# EAGLE design Adafruit NeoKey 1x4 QT I2C (EAGLE 9.6.2)
COMPANY: ADAFRUIT INDUSTRIES; DRAWN: KTOWN; REV: A
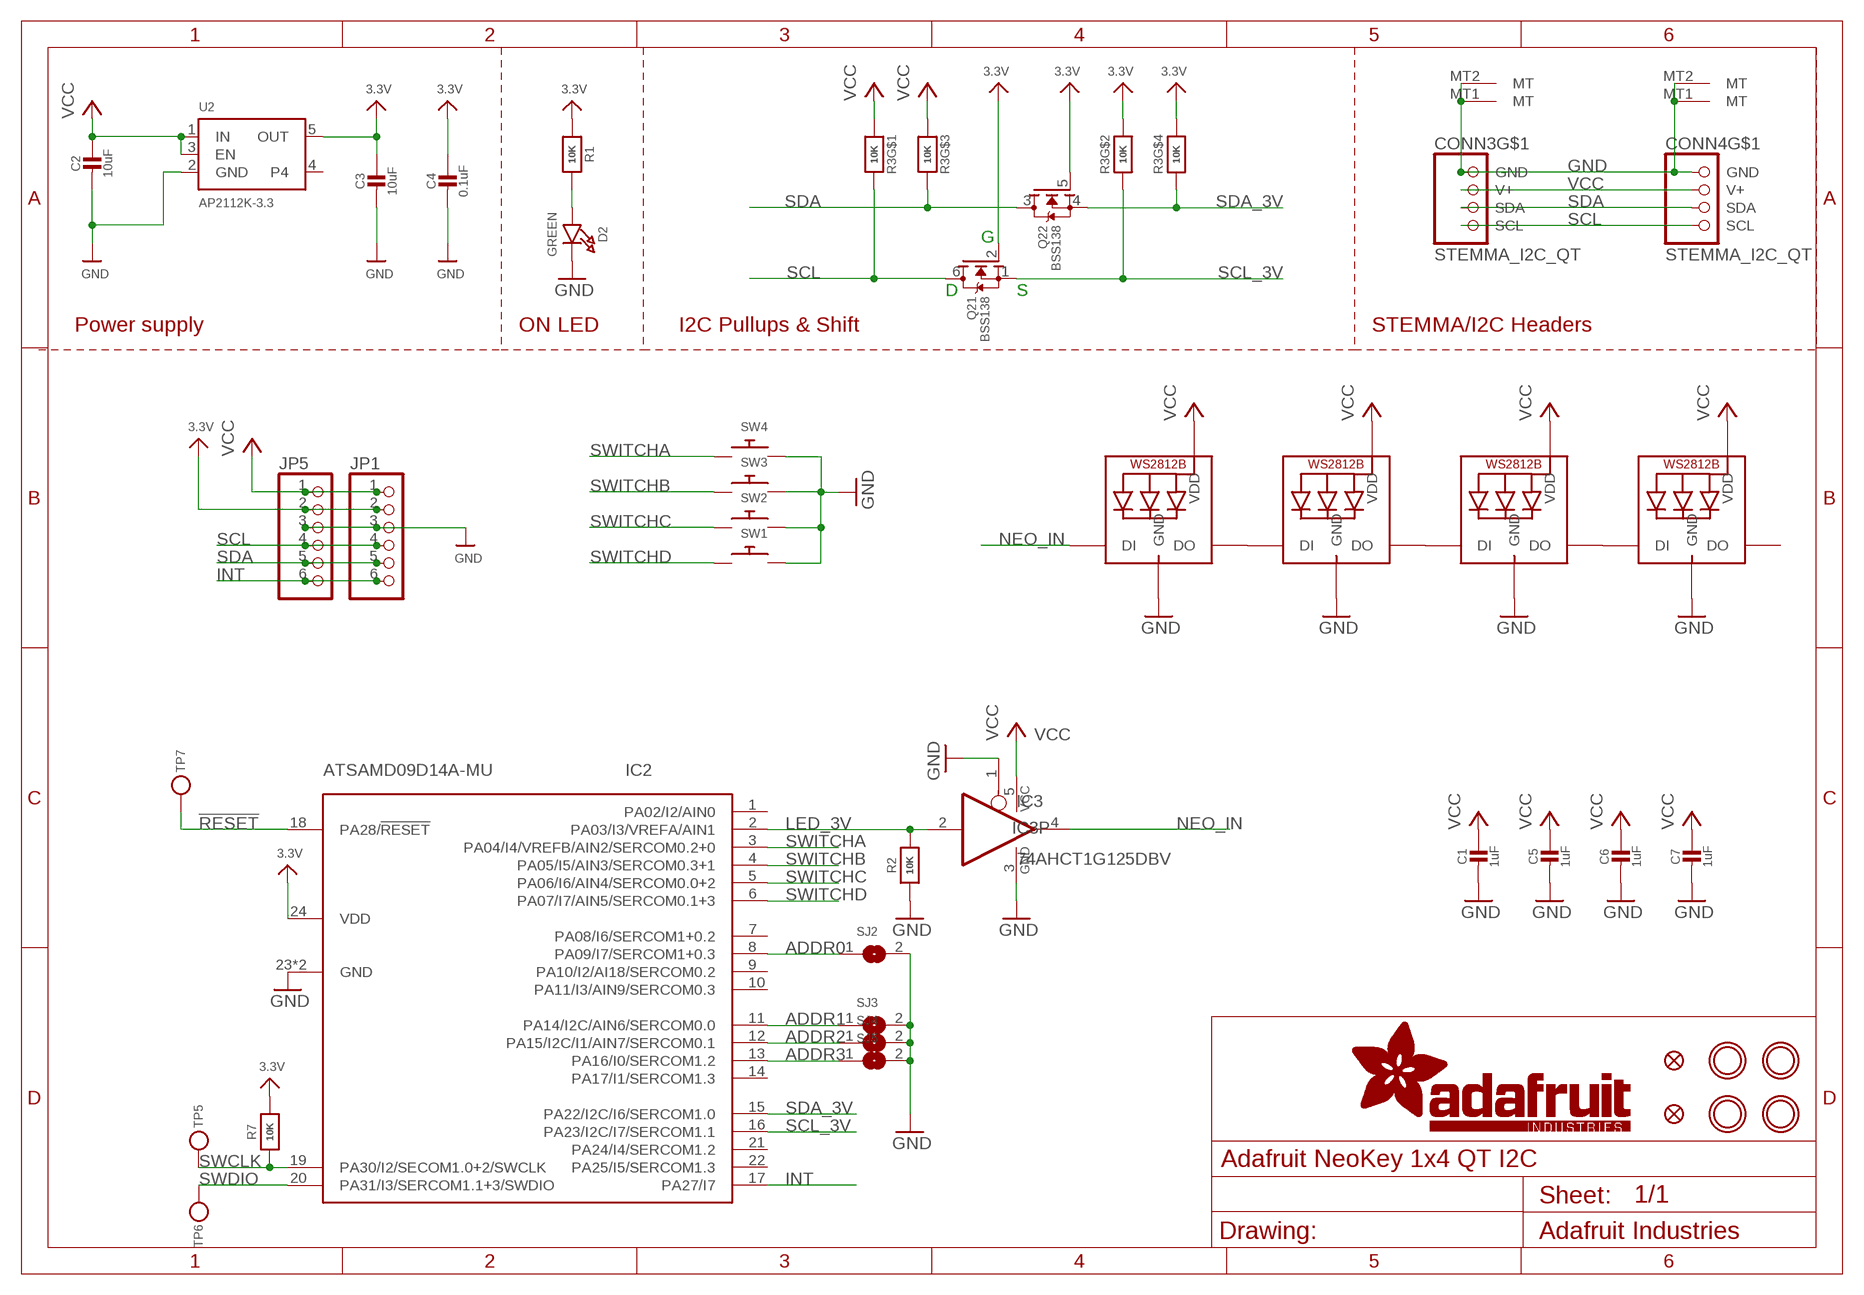
[diagram p0: schematic, sheet 1]

## Parts
C1  1uF  CAP_CERAMIC0603_NO  [0603-NO]
C2  10uF  CAP_CERAMIC0805-NOOUTLINE  [0805-NO]
C3  10uF  CAP_CERAMIC0805-NOOUTLINE  [0805-NO]
C4  0.1uF  CAP_CERAMIC0603_NO  [0603-NO]
C5  1uF  CAP_CERAMIC0603_NO  [0603-NO]
C6  1uF  CAP_CERAMIC0603_NO  [0603-NO]
C7  1uF  CAP_CERAMIC0603_NO  [0603-NO]
CONN3  STEMMA_I2C_QT  [JST_SH4]
CONN4  STEMMA_I2C_QT  [JST_SH4]
D2  GREEN  LED0603_NOOUTLINE  [CHIPLED_0603_NOOUTLINE]
FID1  FIDUCIAL_1MM  [FIDUCIAL_1MM]
FID2  FIDUCIAL_1MM  [FIDUCIAL_1MM]
IC2  ATSAMD09D14A-MU  [QFN24_4MM]
IC3  74AHCT1G125DBV  [SOT23-5]
JP1  HEADER-1X670MIL  [1X06_ROUND_70]
JP5  HEADER-1X670MIL  [1X06_ROUND_70]
LED1  WS2812B_SK6812E  [NEO3535_REVERSE]
LED2  WS2812B_SK6812E  [NEO3535_REVERSE]
LED3  WS2812B_SK6812E  [NEO3535_REVERSE]
LED4  WS2812B_SK6812E  [NEO3535_REVERSE]
Q2  BSS138  MOSFET-N_DUAL  [SOT363]
R1  10K  RESISTOR_0603_NOOUT  [0603-NO]
R2  10K  RESISTOR_0603_NOOUT  [0603-NO]
R3  10K  RESISTOR_4PACK  [RESPACK_4X0603]
R7  10K  RESISTOR_0603_NOOUT  [0603-NO]
SJ2  SOLDERJUMPER  [SOLDERJUMPER_ARROW_NOPASTE]
SJ3  SOLDERJUMPER  [SOLDERJUMPER_ARROW_NOPASTE]
SJ4  SOLDERJUMPER  [SOLDERJUMPER_ARROW_NOPASTE]
SJ5  SOLDERJUMPER  [SOLDERJUMPER_ARROW_NOPASTE]
SW1  SWITCH_PUSHBUTTON_KAILH_SOCKET  [KAILH_SOCKET]
SW2  SWITCH_PUSHBUTTON_KAILH_SOCKET  [KAILH_SOCKET]
SW3  SWITCH_PUSHBUTTON_KAILH_SOCKET  [KAILH_SOCKET]
SW4  SWITCH_PUSHBUTTON_KAILH_SOCKET  [KAILH_SOCKET]
TP5  TESTPOINTROUND1.5MM  [TESTPOINT_ROUND_1.5MM]
TP6  TESTPOINTROUND1.5MM  [TESTPOINT_ROUND_1.5MM]
TP7  TESTPOINTROUND1.5MM  [TESTPOINT_ROUND_1.5MM]
U2  AP2112K-3.3  VREG_SOT23-5  [SOT23-5]
U$3  MOUNTINGHOLE2.5  [MOUNTINGHOLE_2.5_PLATED]
U$17  MOUNTINGHOLE2.5  [MOUNTINGHOLE_2.5_PLATED]
U$19  MOUNTINGHOLE2.5  [MOUNTINGHOLE_2.5_PLATED]
U$21  MOUNTINGHOLE2.5  [MOUNTINGHOLE_2.5_PLATED]

## Nets
3.3V [lowpower]: C3.1 C4.1 IC2.24(VDD) JP1.2 JP5.2 Q2.2(1:G) Q2.5(2:G) R1.1 R3.2 R3.4 R7.2 U2.5(OUT)
!RESET: IC2.18(PA28/!RESET) TP7.P$1
ADDR0: IC2.8(PA09/I7/SERCOM1+0.3) SJ2.1
ADDR1: IC2.11(PA14/I2C/AIN6/SERCOM0.0) SJ3.1
ADDR2: IC2.12(PA15/I2C/I1/AIN7/SERCOM0.1) SJ4.1
ADDR3: IC2.13(PA16/I0/SERCOM1.2) SJ5.1
GND: C1.2 C2.2 C3.2 C4.2 C5.2 C6.2 C7.2 CONN3.1(GND) CONN3.MT1(MT) CONN3.MT2(MT) CONN4.1(GND) CONN4.MT1(MT) CONN4.MT2(MT) D2.C IC2.23(GND) IC2.THERM(GND) IC3.1(OE) IC3.3(GND) JP1.3 JP5.3 LED1.3-GND(GND) LED2.3-GND(GND) LED3.3-GND(GND) LED4.3-GND(GND) R2.1 SJ2.2 SJ3.2 SJ4.2 SJ5.2 SW1.1 SW2.1 SW3.1 SW4.1 U2.2(GND)
INT: IC2.17(PA27/I7) JP1.6 JP5.6
LED_3V: IC2.2(PA03/I3/VREFA/AIN1) IC3.2(I) R2.2
N$1: D2.A R1.2
N$2: LED1.2-DOUT(DO) LED2.4-DIN(DI)
N$3: LED2.2-DOUT(DO) LED3.4-DIN(DI)
N$4: LED3.2-DOUT(DO) LED4.4-DIN(DI)
NEO_IN: IC3.4(O) LED1.4-DIN(DI)
SCL: CONN3.4(SCL) CONN4.4(SCL) JP1.4 JP5.4 Q2.6(1:D) R3.8
SCL_3V: IC2.16(PA23/I2C/I7/SERCOM1.1) Q2.1(1:S) R3.7
SDA: CONN3.3(SDA) CONN4.3(SDA) JP1.5 JP5.5 Q2.3(2:D) R3.6
SDA_3V: IC2.15(PA22/I2C/I6/SERCOM1.0) Q2.4(2:S) R3.5
SWCLK: IC2.19(PA30/I2/SECOM1.0+2/SWCLK) R7.1 TP5.P$1
SWDIO: IC2.20(PA31/I3/SERCOM1.1+3/SWDIO) TP6.P$1
SWITCHA: IC2.3(PA04/I4/VREFB/AIN2/SERCOM0.2+0) SW4.2
SWITCHB: IC2.4(PA05/I5/AIN3/SERCOM0.3+1) SW3.2
SWITCHC: IC2.5(PA06/I6/AIN4/SERCOM0.0+2) SW2.2
SWITCHD: IC2.6(PA07/I7/AIN5/SERCOM0.1+3) SW1.2
VCC [power]: C1.1 C2.1 C5.1 C6.1 C7.1 CONN3.2(V+) CONN4.2(V+) IC3.5(VCC) JP1.1 JP5.1 LED1.1-VDD(VDD) LED2.1-VDD(VDD) LED3.1-VDD(VDD) LED4.1-VDD(VDD) R3.1 R3.3 U2.1(IN) U2.3(EN)
Unconnected: IC2.1(PA02/I2/AIN0) IC2.7(PA08/I6/SERCOM1+0.2) IC2.9(PA10/I2/AI18/SERCOM0.2) IC2.10(PA11/I3/AIN9/SERCOM0.3) IC2.14(PA17/I1/SERCOM1.3) IC2.21(PA24/I4/SERCOM1.2) IC2.22(PA25/I5/SERCOM1.3) LED4.2-DOUT(DO) U2.4

## Notes on the sheet
- G
- D | S
- Power supply | ON LED | I2C Pullups & Shift | STEMMA/I2C Headers

## Library data of the parts
C1-C7 = microbuilder:CAP_CERAMIC: Ceramic Capacitors For new designs, use the packages preceded by an '_' character since they are more reliable: The following footprints should be used on most boards: _0402 - Standard footprint for regular board layouts _0603 - Standard footprint for regular board layouts _0805 - Standard footprint for regular board layouts _1206 - Standard footprint for regular board layouts For extremely tight-pitch boards where space is at a premium, the following 'micro-pitch' footprints can be used (smaller pads, no silkscreen outline, etc.): _0402MP - Micro-pitch footprint for very dense/compact boards _0603MP - Micro-pitch footprint for very dense/compact boards _0805MP - Micro-pitch footprint for very dense/compact boards _1206MP - Micro-pitch footprint for very dense/compact boards
CONN3 CONN4 = microbuilder:STEMMA_I2C
D2 = microbuilder:LED: LED 0603 - 0603 Surface Mount Package 2mA: Green LED - Low Power (3.9mcd, 2ma, 1.7Vf) - Digikey: 475-2709-2-ND Orange LED - Low Power (9.8mcd, 2ma, 1.8Vf) - Digikey: 475-1194-2-ND Red LED - Low Power (5mcd, 2ma, 1.8Vf) - Digikey: 475-1195-2-ND Yellow LED - Low Power (7mcd, 2ma, 1.8Vf) - Digikey: 475-1196-2-ND 5mA: Blue LED - Low Power (17mcd, 5ma, 2.9Vf) - Digikey: LNJ937W8CRACT-ND 0805 - 0805 Surface Mount Package 2mA: Red LED (8.8mcd, 2mA, 1.8Vf, Clear) - Low Power [Digikey: 475-2510-1-ND] Green LED (5mcd, 2mA, 1.8Vf, Clear) - Low Power [Digikey: 475-2730-1-ND] Yellow LED (11.3mcd, 2mA, 1.8Vf, Clear) - Low Power [Digikey: 475-2555-1-ND] 20mA: Red LED (104mcd, 20mA, Diffused) - LS R976 [Digikey: 475-1278-6-ND] Red LED (12mcd, 20mA, 2.0Vf, Clear) - APT2012EC [Digikey: 754-1128-1-ND] Green LED (15mcd, 20mA, 2.2Vf, Clear) - APT2012GC [Digikey: 754-1131-1-ND] Orange LED (160mcd, 20mA, 2.1Vf, Clear) - APT2012SECK [Digikey: 754-1130-1-ND] 1206 - 1206 Surface Mount Package Green LED (26mcd, 20mA, Diffused) - LG N971 [Digikey: 475-1407-6-ND] Red LED (15mcd, 20mA, Diffused) - LH N974 [Digikey: 475-1416-6-ND] Cree - Cree High-Power Surface Mount LEDs XPEBWT-L1-0000-00D50 - White 111lm 350mA 2.9Vf 6200K 110° XTEAWT-00-0000-00000LEE3 - White 114lm 350mA 2.85Vf 5000K 115° Everlight - Everlight 45-21 Series Surface Mount LEDs 45-21/QK2C-B2832AC2CB2/2T - Warm White 2000mcd 20mA 3.25Vf 3050K 120° 45-21/LK2C-B38452C4CB2/2T - Nuetral White 2000mcd 20mA 3.25Vf 4150K 120° 45-21/LK2C-B50634C6CB2/2T - Cold White 2200mcd 20mA 3.25Vf 5650K 120° PLCC2 Reverse Mount LS T77K-J1L2-1-0-2-R18-Z - Red 11.25mcd 2mA 1.8Vf 630nm 120° LO T77K-L1M2-24-Z - Orange 19.6mcd 2mA 1.8Vf 606nm 120° LY T77K-K2M1-26-Z - Yellow 15.7mcd 2mA 1.8Vf 587nm 120°
FID1 FID2 = microbuilder:FIDUCIAL: Fiducial Alignment Points Various fiducial points for machine vision alignment.; BOM: EXCLUDE
IC2 = microbuilder:ATSAMD09D14A
IC3 = 74xx-little-us:74*1G125: Single Bus Buffer Gate with 3-State Output
JP1 JP5 = microbuilder:HEADER-1X6: PIN HEADER
LED1-LED4 = microbuilder:WS2812B
Q2 = microbuilder:MOSFET-N_DUAL: Dual N-Channel MOSFET SOT363 (2.0x1.25mm) 2N7002PS - 60V, 320mA [Digikey: 568-5984-1-ND]
R1 R2 R7 = microbuilder:RESISTOR: Resistors For new designs, use the packages preceded by an '_' character since they are more reliable: The following footprints should be used on most boards: _0402 - Standard footprint for regular board layouts _0603 - Standard footprint for regular board layouts _0805 - Standard footprint for regular board layouts _1206 - Standard footprint for regular board layouts For extremely tight-pitch boards where space is at a premium, the following 'micro-pitch' footprints can be used (smaller pads, no silkscreen outline, etc.): _0402MP - Micro-pitch footprint for very dense/compact boards _0603MP - Micro-pitch footprint for very dense/compact boards _0805MP - Micro-pitch footprint for very dense/compact boards _1206MP - Micro-pitch footprint for very dense/compact boards
R3 = microbuilder:RESISTOR_4PACK: Resistor Packs (4 resistors) 4 x 0603 10K 1/16W - Digikey: YC164J-10KCT-ND
SJ2-SJ5 = microbuilder:SOLDERJUMPER: SMD Solder JUMPER Solder the two pads together to create a connection, or remove the solder to break it. REFLOW - Use this footprint for solder paste and reflow ovens. WAVE - Use this footprint for hand-soldering (larger pads). CLOSED - Has a trace between the two pads to ensure it is closed by default. The trace needs to be cut to disable the jumper, and can be closed again by creating a solder bridge between the two pads.; BOM: EXCLUDE
SW1-SW4 = adafruit_electromech:SWITCH_PUSHBUTTON: Buttons SOFTTOUCHSMD_SJ - Soft touch temporary push button (Super Junk Akihabara) Compatible with SKPMANE010 [Mouser: 688-SKPMAN] C&K_KSS = Digikey: KSS221GLFS
TP5-TP7 = microbuilder:TESTPOINT: Test Point Various test points for characterisation and PCB testing TESTPOINT_SMT - Compact Surface Mount Test Point [Digikey: 5016KTR-ND]
U2 = microbuilder:VREG_SOT23-5: SOT23-5 Fixed Voltage Regulators Part Current Out V Out V In V Dropout θJA (°C/W) TJ (°C) Digikey Part No. ADP121 150mA 3.3V 3.4-5.5V 0.09V @ 150mA -- -- ADP121-AUJZ33R7CT-ND ADP121 150mA 3.0V 3.1-5.5V 0.09V @ 150mA -- -- ADP121-AUJZ30R7CT-ND ADP122 300mA 3.3V 3.4-5.5V 0.085V @ 300mA -- -- ADP122AUJZ-3.3-R7CT-ND ADP1712 300mA 3.3V 3.5-5.5V 0.17V @ 300mA -- -- ADP1712AUJZ-3.3-R7TR-ND AP7311 (Low Cost) 150mA 3.3V 3.5-6V 0.15V @ 150mA -- -- AP7311-33WG-7DICT-ND LD39015M18R 150mA 1.8V 1.9V-5.5V 0.08V @ 100mA -- -- 497-6977-1-ND LP2985A-33DBVR 150mA 3.3V 3.3-16V 0.28V @ 150mA 206 150 296-18479-1-ND MCP1824T-3302E/OT 300mA 3.3V 3.5V-6V 0.2V @ 300mA -- -- MCP1824T-3302E/OTCT-ND MIC5205-2.5YM5 TR 150mA 2.5V 2.7-16V 0.165V @ 150mA -- -- 576-1257-2-ND MIC5205-3.0YM5 TR 150mA 3.0V 3.2V-16V 0.165V @ 150mA -- -- 576-1258-2-ND MIC5205-3.3YM5 TR 150mA 3.3V 3.5V-16V 0.165V @ 150mA -- -- 576-1259-2-ND TPS780330220 150mA 3.3V+2.2V 3.6-5.5V 250mV Max -- -- 296-23332-1-ND TDA3663/N1,135 100mA 3.3V 3.5-45V 0.18V @ 50mA -- -- 568-5343-1-ND Max operating temp can be calculated using θJA, TJ (max junction temperature), and power in watts. Set the "Maximum Ambient Temperature" until it reaches TJ ("Max Junction Temperature"), which is the absolute limit for safe use of the regulator: Heat Sink Temperature Calculator <http://www.daycounter.com/Calculators/Heat-Sink-Temperature-Calculator.phtml> For example, With 12V source into a 3.3V LP2985 and a 30mA load, we are dissipating (12V-3.3V) * 0.03A = 0.261W. With a θJA of 206 °C/W, a TJ of 150°C, and 261mW we can safely use the chip without a heat sink up to 75°C (=147.1°C Junction Temperature).
U$3 U$17 U$19 U$21 = microbuilder:MOUNTINGHOLE: Mounting Hole For #2 screws (0.086"/2.18mm width, 0.094"/2.4mm hole) use 2.5mm; BOM: EXCLUDE

## Net classes
1 power: width 0.406 mm
2 lowpower: width 0.254 mm, drill 0.483 mm

## Board
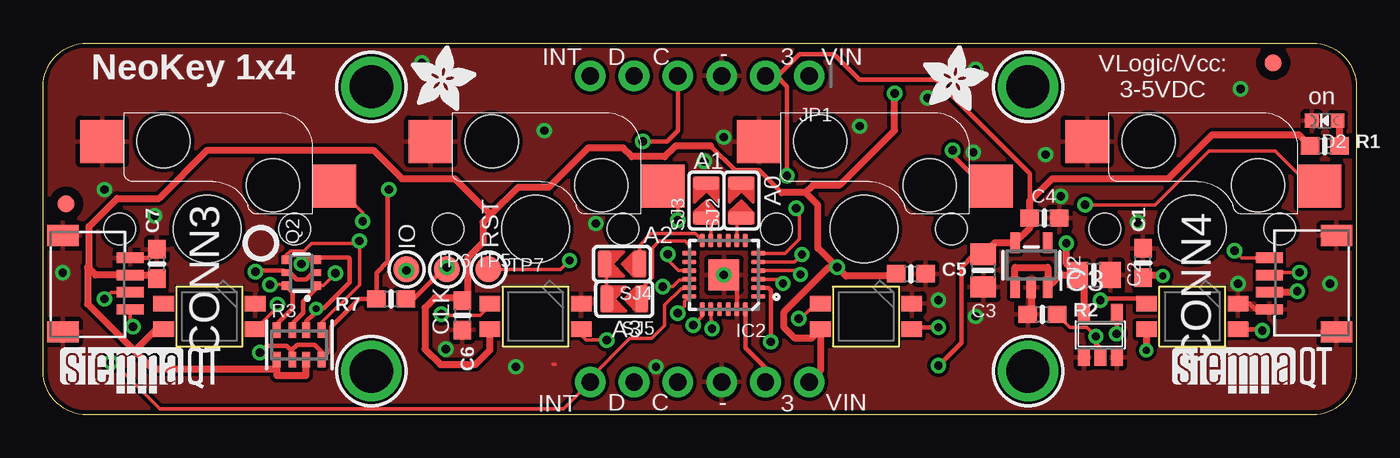
[diagram p1: board, top side]
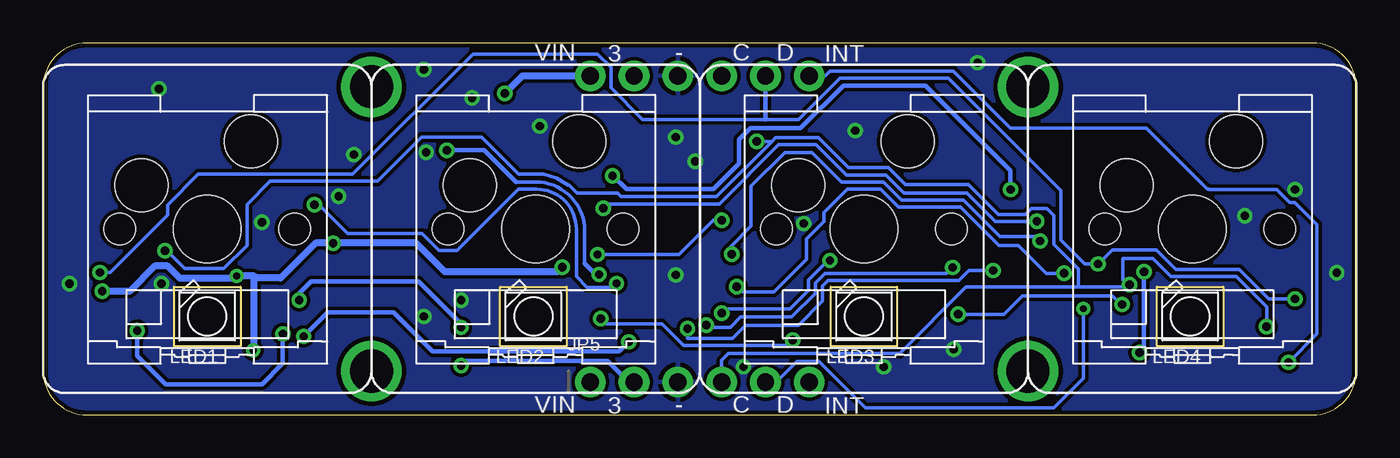
[diagram p2: board, bottom side, seen from below]

Size 76.2 x 21.59 mm. Coordinates in mm from the lower left corner, seen from the top.
Outline: 76.2,19.05 76.2,2.54 arc-90 73.66,0 2.54,0 arc-90 0,2.54 0,19.05 arc-90 2.54,21.59 73.66,21.59 arc-90 76.2,19.05
Copper layers (1*16): Top 0.035mm / dielectric 1.5mm / Bottom 0.035mm
Design rules "adafruit *": minimum track width 8mil, minimum drill 15.5mil, track to track 8mil, track to pad 8mil, pad to pad 8mil, via to via 8mil, smd to smd 8mil, copper to edge 10mil, drill to drill 8mil, minimum pad ring 10mil, minimum via ring 8mil, stop-mask expansion 2mil, vias tented up to drill 20mil, thermal gap 10mil

### Footprints (pad centres in the part's own frame; a part is rotated, then mirrored left to right if it is on the bottom)
0603-NO = smd 1.075 x 1: 1 -0.85,0; 2 0.85,0
0805-NO = smd 1.24 x 1.5: 1 -0.95,0; 2 0.95,0
JST_SH4 = smd 0.6 x 1.55: 1 -1.5,2.514; 2 -0.5,2.514; 3 0.5,2.514; 4 1.5,2.514 | smd 1.2 x 1.8: MT1 -2.8,-1.386; MT2 2.8,-1.386
CHIPLED_0603_NOOUTLINE = smd 0.8 x 0.8: A 0,-0.75; C 0,0.75
FIDUCIAL_1MM = smd 1 x 1: 1 0,0
QFN24_4MM = smd 0.8 x 0.28: 1 -2,1.25; 2 -2,0.75; 3 -2,0.25; 4 -2,-0.25; 5 -2,-0.75; 6 -2,-1.25; 13 2,-1.25; 14 2,-0.75; 15 2,-0.25; 16 2,0.25; 17 2,0.75; 18 2,1.25 | smd 0.28 x 0.8: 7 -1.25,-2; 8 -0.75,-2; 9 -0.25,-2; 10 0.25,-2; 11 0.75,-2; 12 1.25,-2; 19 1.25,2; 20 0.75,2; 21 0.25,2; 22 -0.25,2; 23 -0.75,2; 24 -1.25,2 | smd 1.778 x 1.778: THERM 0,0
SOT23-5 = smd 0.69 x 0.99: 1 -0.95,-1.29; 2 0,-1.29; 3 0.95,-1.29; 4 0.95,1.3; 5 -0.95,1.3
1X06_ROUND_70 = drill 1 pad 1.778: 1 -6.35,0; 2 -3.81,0; 3 -1.27,0; 4 1.27,0; 5 3.81,0; 6 6.35,0
NEO3535_REVERSE = smd 1.2 x 0.9 bottom: 1-VDD 2.65,-0.75; 2-DOUT 2.65,0.75; 3-GND -2.65,0.75; 4-DIN -2.65,-0.75
SOT363 = smd 0.5 x 0.5: 1 -0.75,-0.9; 3 0.75,-0.9; 4 0.75,0.9; 6 -0.75,0.9 | smd 0.4 x 0.5: 2 0,-0.9; 5 0,0.9
RESPACK_4X0603 = smd 0.45 x 0.9: 1 -1.3,-0.85; 2 -0.4,-0.85; 3 0.4,-0.85; 4 1.3,-0.85; 5 1.3,0.85; 6 0.4,0.85; 7 -0.4,0.85; 8 -1.3,0.85
SOLDERJUMPER_ARROW_NOPASTE = smd 0.762 x 1.524: 1 -1.016,0; 2 1.016,0
KAILH_SOCKET = smd 2.55 x 2.5 bottom: 1 6.09,5.08; 2 -7.36,2.5 | hole 3.9: 0,0 | hole 3.063: 2.54,5.08; -3.81,2.54 | hole 1.813: 5.08,0; -5.08,0
TESTPOINT_ROUND_1.5MM = smd 1.5 x 1.5: P$1 0,0
SOT23-5' = smd 0.55 x 1.2: 1 -0.95,-1.3; 2 0,-1.3; 3 0.95,-1.3; 4 0.95,1.3; 5 -0.95,1.3
MOUNTINGHOLE_2.5_PLATED = drill 2.5 pad 3.2: P$1 0,0

### Placement (x,y rotation side)
C1  63.82,8.83 90 top
C2  60.96,8.13 0 top
C3  54.55,8.38 270 top
C4  58.1,11.43 0 top
C5  50.36,8.19 0 top
C6  24.32,5.78 270 top
C7  6.6,8.76 90 top
CONN3  2.54,7.62 270 top
CONN4  73.66,7.62 90 top
D2  74.36,17.08 90 top
FID1  71.37,20.45 0 top
FID2  1.33,12.26 0 top
IC2  39.5,8.13 180 top
IC3  61.34,4.64 0 top
JP1  38.1,19.68 180 top
JP5  38.1,1.91 0 bottom
LED1  66.67,5.71 0 bottom
LED2  47.75,5.71 0 bottom
LED3  28.57,5.71 0 bottom
LED4  9.65,5.71 0 bottom
Q2  14.99,8.26 90 top
R1  74.36,15.62 0 top
R2  57.98,5.84 0 top
R3  14.86,4.06 0 top
R7  20.19,6.73 180 top
SJ2  40.51,12.45 90 top
SJ3  38.48,12.45 90 top
SJ4  33.59,8.76 180 top
SJ5  33.72,6.73 180 top
SW1  9.53,10.79 0 bottom
SW2  28.57,10.79 0 bottom
SW3  47.62,10.79 0 bottom
SW4  66.67,10.79 0 bottom
TP5  23.43,8.45 0 top
TP6  21.08,8.45 0 top
TP7  25.84,8.45 0 top
U2  AP2112K-3.3  [SOT23-5']  57.34,8.7 0 top
U$2  [ADAFRUIT_3.5MM]  21.34,17.65 0 top
U$3  57.15,19.05 0 top
U$9  [ADAFRUIT_3.5MM]  51.05,17.65 0 top
U$17  19.05,19.05 0 top
U$19  57.15,2.54 0 top
U$21  19.05,2.54 0 top
U$25  [PCBFEAT-REV-040]  12.64,9.97 0 top
U$30  [STEMMAQT]  1.02,1.27 0 top
U$31  [STEMMAQT]  65.53,1.27 0 top

### Tracks (layer width: path | path; a pad name or v marks a point on that pad's centre or on a via)
3.3V  (via drill 0.48)
  Top 0.254: IC2.24 40.75,3.9 41.91,2.74 JP5.2 | Q2.2 15.63,8.26 15.25,7.87 14.72,7.87 14.34,8.26 Q2.5 13.96,8.38 12.38,8.38 v12.32,8.32 | 16.16,3.26 16.16,3.65 15.75,4.06 14.73,4.06 14.46,3.79 R3.2 14.46,3.68 14.13,4.01 12.96,4.01 v12.57,3.62 | v51.94,2.86 53.28,4.19 53.28,8.57 54.04,9.33 C3.1 | 16.16,3.26 R3.4 | 16.16,3.26 16.71,3.82 16.71,5.12 18.33,6.73 R7.2 19.34,8.26 20,8.91 20,13.02 v20.07,13.08 | v43.16,13.88 43.17,13.89 43.17,19.06 42.55,19.68 JP1.2 42.65,19.68 43.89,20.93 45.9,20.93 47.37,19.46 51.82,19.46 57.25,14.02 57.25,12.42
  Top 0.406: C3.1 55.21,10 U2.5 57.25,10.86 C4.1 57.25,12.42 58.55,13.72 65.28,13.72 67.82,16.26 72.87,16.26 R1.1
  Bottom 0.254: v12.57,3.62 12.32,3.87 v12.32,8.32 | JP5.2 42.23,1.91 43.45,3.12 51.68,3.12 v51.94,2.86 | v43.16,13.88 43.13,13.88 42.35,13.1 37.3,13.1 35.81,14.58 35.81,15.98 35.15,16.65 32.24,16.65 29.77,19.13 25.01,19.13 20.07,14.19 v20.07,13.08
!RESET  (via drill 0.48)
  Top 0.203: IC2.18 37.21,6.59 37.21,6.29 v36.83,5.91 | TP7.P$1 30.02,8.45 v30.54,8.97
  Bottom 0.203: v30.54,8.97 30.67,8.97 31.8,7.84 31.8,7.22 32.86,6.16 36.58,6.16 v36.83,5.91
ADDR0
  Top 0.203: SJ2.1 40.45,11.43 40.25,11.23 IC2.8
ADDR1
  Top 0.203: IC2.11 38.75,11.16 SJ3.1
ADDR2
  Top 0.203: SJ4.1 34.61,9.84 35.29,10.52 37.85,10.52 IC2.12
ADDR3
  Top 0.203: SJ5.1 34.73,7.35 35.36,7.97 35.36,9.7 35.74,10.09 37.24,10.09 37.5,9.83 IC2.13
GND  (via drill 0.48)
  Top 0.203: SJ4.2 32.7,8.64 SJ5.2 | 29.72,2.92 29.59,2.92
  Top 0.254: IC2.23 40.25,7.38 IC2.THERM | CONN3.1 6.11,9.12 C7.2 | LED1.3-GND 69.99,6.46 70.33,6.12 CONN4.1
  Top 0.406: U2.2 57.34,6.06 R2.1
  other vias: 3.56,13.08 1.14,8.26 39.5,16.13 29.08,16.51 58.17,15.11 54.1,5.71 74.68,7.62 69.47,18.92 59.05,12.7 63.5,11.18 39.5,8.13 51.94,6.67 23.37,3.81 38.35,14.73 21.97,20.45 47.37,16.76 51.31,18.41 54.1,20.07 53.98,15.24 6.48,11.56 27.43,2.79 32.07,11.11 35.56,2.79 69.34,7.62
  pour Bottom: 76.2,21.59 0,21.59 0,0 76.2,0
  pour Top: 76.2,21.59 0,21.59 0,0 76.2,0
INT  (via drill 0.48)
  Top 0.203: IC2.17 37.12,7.38 37.06,7.32 37.01,7.32 36.07,6.38 36.07,5.21 35.31,4.45 34.04,4.45 31.75,2.16 JP5.6 30.2,0.36 6.76,0.36 4.06,3.05 v3.94,3.05
  Bottom 0.203: v3.94,3.05 2.29,4.7 2.29,11.05 3.57,12.33 3.87,12.33 4.62,13.08 8.55,13.08 8.57,13.1 8.66,13.1 12.19,16.64 20.07,16.64 23.39,19.96 30.54,19.96 30.82,19.68 JP1.6
LED_3V  (via drill 0.48)
  Top 0.203: R2.2 59.59,5.08 60.57,5.08 v61.09,4.56
  Top 0.254: v42.23,4.24 42.23,7.23 42.08,7.38 IC2.2 | IC3.2 61.34,3.87 61.09,4.13 v61.09,4.56
  Bottom 0.254: v61.09,4.56 59.69,5.96 55.87,5.96 53.59,3.68 42.79,3.68 v42.23,4.24
N$1
  Top 0.406: D2.A 75.21,16.98 R1.2
N$2  (via drill 0.48)
  Top 0.254: v51.94,5.08 51.4,5.08 51.38,5.07 50.51,5.07 LED2.4-DIN | v61.34,6.67 61.72,6.67 61.81,6.76 63.73,6.76 LED1.2-DOUT
  Bottom 0.254: v51.94,5.08 51.94,5.27 54.42,7.75 60.64,7.75 61.34,7.05 v61.34,6.67
N$3  (via drill 0.48)
  Top 0.203: v43.84,5.59 43.85,5.6 43.98,5.6 44.85,6.46 LED2.2-DOUT | v32.7,4.35 31.5,4.35 31.24,4.6
  Top 0.254: LED3.4-DIN 31.24,4.95 31.24,4.6
  Bottom 0.203: v43.84,5.59 43.52,5.27 40.29,5.27 39.05,4.03 33.02,4.03 v32.7,4.35
N$4  (via drill 0.48)
  Top 0.203: v23.11,5.84 23.18,5.78 25.34,5.78 25.93,6.36 LED3.2-DOUT | LED4.4-DIN 13.59,6.25 v13.59,6.41
  Bottom 0.203: v13.59,6.41 13.65,6.41 14.16,6.92 19.37,6.92 20.45,5.84 v23.11,5.84
NEO_IN  (via drill 0.48)
  Top 0.254: IC3.4 v62.29,4.7 | v70.74,4.89 70.62,5 70.47,5 70.43,4.96 LED1.4-DIN
  Bottom 0.254: v62.29,4.7 62.29,2.98 63.5,1.78 69.09,1.78 70.74,3.43 v70.74,4.89
SCL  (via drill 0.48)
  Top 0.203: v5.21,5.13 5.05,5.28 CONN3.4 | Q2.6 14.02,7.57 v13.16,7.57 | v69.13,9.53 69.54,9.12 CONN4.4
  Top 0.254: Q2.6 14.47,7.12 14.47,6.17 13.56,5.26 R3.8 | JP1.4 36.83,16.51 36.2,15.88 v34.8,15.88
  Bottom 0.203: v5.21,5.13 5.21,6.28 6.96,8.03 10.76,8.03 11.81,9.08 13.54,9.08 13.54,7.82 13.29,7.57 v13.16,7.57 13.23,7.57 13.38,7.42 16.13,7.42 | 16.13,7.42 22.64,7.42 26.48,3.58 36.42,3.58 36.83,3.17 JP5.4 | 33.91,15.88 37.12,12.67 42.66,12.67 42.87,12.88 45.2,12.88 45.68,13.35 45.75,13.35 45.9,13.44 46.42,13.74 47.17,13.97 48.6,13.97 50.75,16.12 54.24,16.12 56.79,13.56 63.02,13.56 64.37,12.21 64.37,9.84 65.72,8.49 67.97,8.49 69.01,9.53 v69.13,9.53 | v34.8,15.88 33.91,15.88 | 33.91,15.88 33.7,16.09 31.2,16.09 29.46,14.35 27.15,14.35 26.16,13.37 22.51,13.37 20.79,11.65 19.2,11.65 18.85,11.99 17.96,11.99 17.55,11.58 17.55,9.89 16.13,8.46 16.13,7.42
SCL_3V  (via drill 0.48)
  Top 0.203: v35.95,7.45 36.56,7.45 36.94,7.82 37.44,7.82 IC2.16 | Q2.1 16.27,7.5 16.97,8.21 v16.97,8.22
  Top 0.254: R3.7 14.46,5.29 15.09,5.93 15.09,6.58 15.89,7.38 Q2.1
  Bottom 0.203: v35.95,7.45 35.95,7.51 35.58,7.14 33.78,7.14 31.9,9.02 31.9,10.21 30.88,11.23 30.88,11.75 29.53,13.1 27.62,13.1 26.58,12.06 22.97,12.06 20.76,9.84 19.61,9.84 17.98,8.22 v16.97,8.22
SDA  (via drill 0.39, 0.48)
  Top 0.203: CONN3.3 3.94,7.12 v3.56,6.73 | v15.84,6.17 15.72,6.05 15.72,5.87 | CONN4.3 71.29,8.27 v72.9,8.27
  Top 0.254: Q2.3 15.23,9.01 v14.99,8.76 15.37,9.14 17.72,9.14 17.78,9.08 17.78,7.68 16.27,6.17 v15.84,6.17 | R3.6 15.26,5.42 15.72,5.87
  Bottom 0.203: v3.56,6.73 5.08,6.73 6.79,8.45 10.48,8.45 11.62,9.59 14.16,9.59 v14.99,8.76 15.75,8.76 17.14,10.16 17.14,13.02 23.69,19.56 29.97,19.56 32.37,17.16 34.29,17.16 41.41,17.16 43.26,19 43.26,20.18 44.03,20.95 51.24,20.95 58.23,13.97 67.2,13.97 68.98,12.2 68.98,11.6 72.31,8.27 v72.9,8.27 | v15.84,6.17 15.84,2.13 17.55,0.42 28.49,0.42 31.18,3.11 32.45,3.11 33.66,1.91 JP5.5
  Bottom 0.254: JP1.5 34.29,17.16
SDA_3V  (via drill 0.48)
  Top 0.203: Q2.4 14.09,9.26 14.35,9.53 15.14,9.53 15.57,9.96 18.35,9.96 v18.35,10.1 18.35,7.56 16.16,5.36 R3.5 | v36.24,9.33 36.24,9.01 36.87,8.39 37.49,8.39 IC2.15
  Bottom 0.203: v36.24,9.33 36.3,9.39 36.3,9.78 35.12,10.96 35.12,13.27 33.17,15.22 31.6,15.22 29.89,13.51 27.45,13.51 26.41,12.46 22.8,12.46 20.69,10.35 18.61,10.35 v18.35,10.1
SWCLK  (via drill 0.48)
  Top 0.203: IC2.19 38.25,5.74 v37.72,5.21 | v23.43,8.56 TP5.P$1
  Top 0.254: TP5.P$1 23.2,8.45 21.49,6.73 R7.1
  Bottom 0.203: v37.72,5.21 37.59,5.08 36.32,5.08 35.73,5.68 32.77,5.68 31.39,7.05 31.39,7.66 30.84,8.22 23.77,8.22 v23.43,8.56
SWDIO  (via drill 0.48)
  Top 0.203: IC2.20 38.75,5.53 38.81,5.46 v38.81,5.02 | TP6.P$1 v21.08,8.38
  Bottom 0.203: v38.81,5.02 38.81,4.45 36.2,4.45 35.43,5.21 32.38,5.21 30.99,6.6 30.99,7.49 30.67,7.81 23.05,7.81 22.48,8.38 v21.08,8.38
SWITCHA  (via drill 0.48)
  Top 0.203: IC2.3 42.8,7.88 42.93,7.76 v42.93,7.63 | v60.45,12.19 64.52,12.19 67.65,15.33 71.5,15.33 73.53,13.29 SW4.2
  Bottom 0.203: v42.93,7.63 42.93,7.41 44.63,7.41 45.26,8.04 45.26,10.8 arc-90 47.56,13.1 48.61,13.1 52.18,9.53 53.23,9.53 54.22,10.53 58.53,10.53 60.19,12.19 v60.45,12.19
SWITCHB  (via drill 0.48)
  Top 0.203: IC2.4 43.72,8.38 v43.94,8.16 | 54.57,13.29 SW3.2
  Top 0.254: v52.77,15.37 52.77,15.1 54.57,13.29
  Bottom 0.203: 44.78,8.8 44.78,10.68 arc-90 47.62,13.53 48.77,13.53
  Bottom 0.254: 44.78,8.8 44.13,8.16 v43.94,8.16 | v52.77,15.37 50.61,15.37 48.77,13.53
SWITCHC  (via drill 0.48)
  Top 0.203: IC2.5 43.59,8.88 v44.03,9.31 | v36.83,11.3 36.83,12.4 SW2.2
  Bottom 0.203: v44.03,9.31 39.31,9.31 37.32,11.3 v36.83,11.3
SWITCHD  (via drill 0.48)
  Top 0.203: IC2.6 43.03,9.38 43.88,10.22 43.88,11.81 v43.69,12 | v18.54,11.24 18.54,11.75 17.72,12.57 17.61,12.57 SW1.2
  Bottom 0.203: v43.69,12 43.43,12.26 36.96,12.26 33.53,15.68 31.37,15.68 29.6,13.91 27.28,13.91 26.24,12.87 22.59,12.87 20.95,11.24 v18.54,11.24
VCC  (via drill 0.39, 0.48)
  Top 0.254: 42.85,12.9 41.53,14.22 40.13,14.22 38.73,15.62
  Top 0.406: C7.1 6.4,8.12 CONN3.2 3.04,8.12 2.67,8.49 | U2.1 56.39,8.57 58.29,8.57 U2.3 59.02,8.13 C2.1 | R3.1 13.56,2.67 | 13.56,2.67 13.56,2.29 15.26,2.29 R3.3 | C5.1 49.38,8.06 46.58,8.06 v46.08,8.57 | C2.1 59.37,8.77 v59.37,9.97 | v72.77,7.18 72.72,7.12 CONN4.2 | v46.08,8.57 46.08,8.55 45.56,8.55 42.99,5.98 42.99,5.08 43.62,4.45 44.58,4.45 LED2.1-VDD 45.1,2.56 JP5.1 | C2.1 60.39,7.75 IC3.5 | v46.08,8.57 44.96,9.69 44.96,12.19 44.25,12.9 | 25.97,11.62 27.56,13.21 29.34,13.21 31.62,15.49 33.66,15.49 34.16,14.99 36.07,14.99 36.7,15.62 38.73,15.62 | 25.97,11.62 25.53,11.18 25.53,10.01 24.64,9.12 24.64,6.95 C6.1 24.15,6.79 22.73,6.79 22.16,6.22 22.16,3.81 23.05,2.92 25.08,2.92 25.93,3.76 LED3.1-VDD | 44.25,12.9 42.85,12.9 | 44.25,12.9 44.69,13.35 46.23,13.35 49.4,16.52 v49.4,18.67 | 2.67,8.49 2.58,8.58 2.58,6.44 5.3,3.71 | 2.67,8.49 2.67,10.95 4.29,12.57 6.73,12.57 9.53,15.37 19.18,15.37 20.83,13.72 23.88,13.72 25.97,11.62 | 13.56,2.67 6.35,2.67 5.3,3.71 | LED4.1-VDD 6.55,4.96 5.3,3.71 | v64.96,8.06 64.92,8.1 63.94,8.1 C1.1 | LED1.1-VDD 64.03,3.76 v64.01,3.75
  Bottom 0.406: v72.77,7.18 71.18,7.18 69.72,8.64 68.96,8.64 68.26,7.94 65.09,7.94 v64.96,8.06 63.94,8.06 63.94,7.94 | 63.94,7.94 62.42,7.94 60.39,9.97 v59.37,9.97 54.55,9.97 52.9,8.32 46.33,8.32 v46.08,8.57 | JP1.1 48.39,19.68 v49.4,18.67 | v64.01,3.75 63.94,3.81 63.94,7.94

### Text on the board
tPlace: INT | D | C | - | 3 | VIN | NeoKey 1x4 | VLogic/Vcc: / 3-5VDC | on | A1 | A0 | RST | IO | A2 | CLK | A3 | INT | D | C | - | 3 | VIN
bPlace: INT | D | C | - | 3 | VIN | INT | D | C | - | 3 | VIN